# EAGLE design WiFi_Board_R0 (EAGLE 6.6.0)
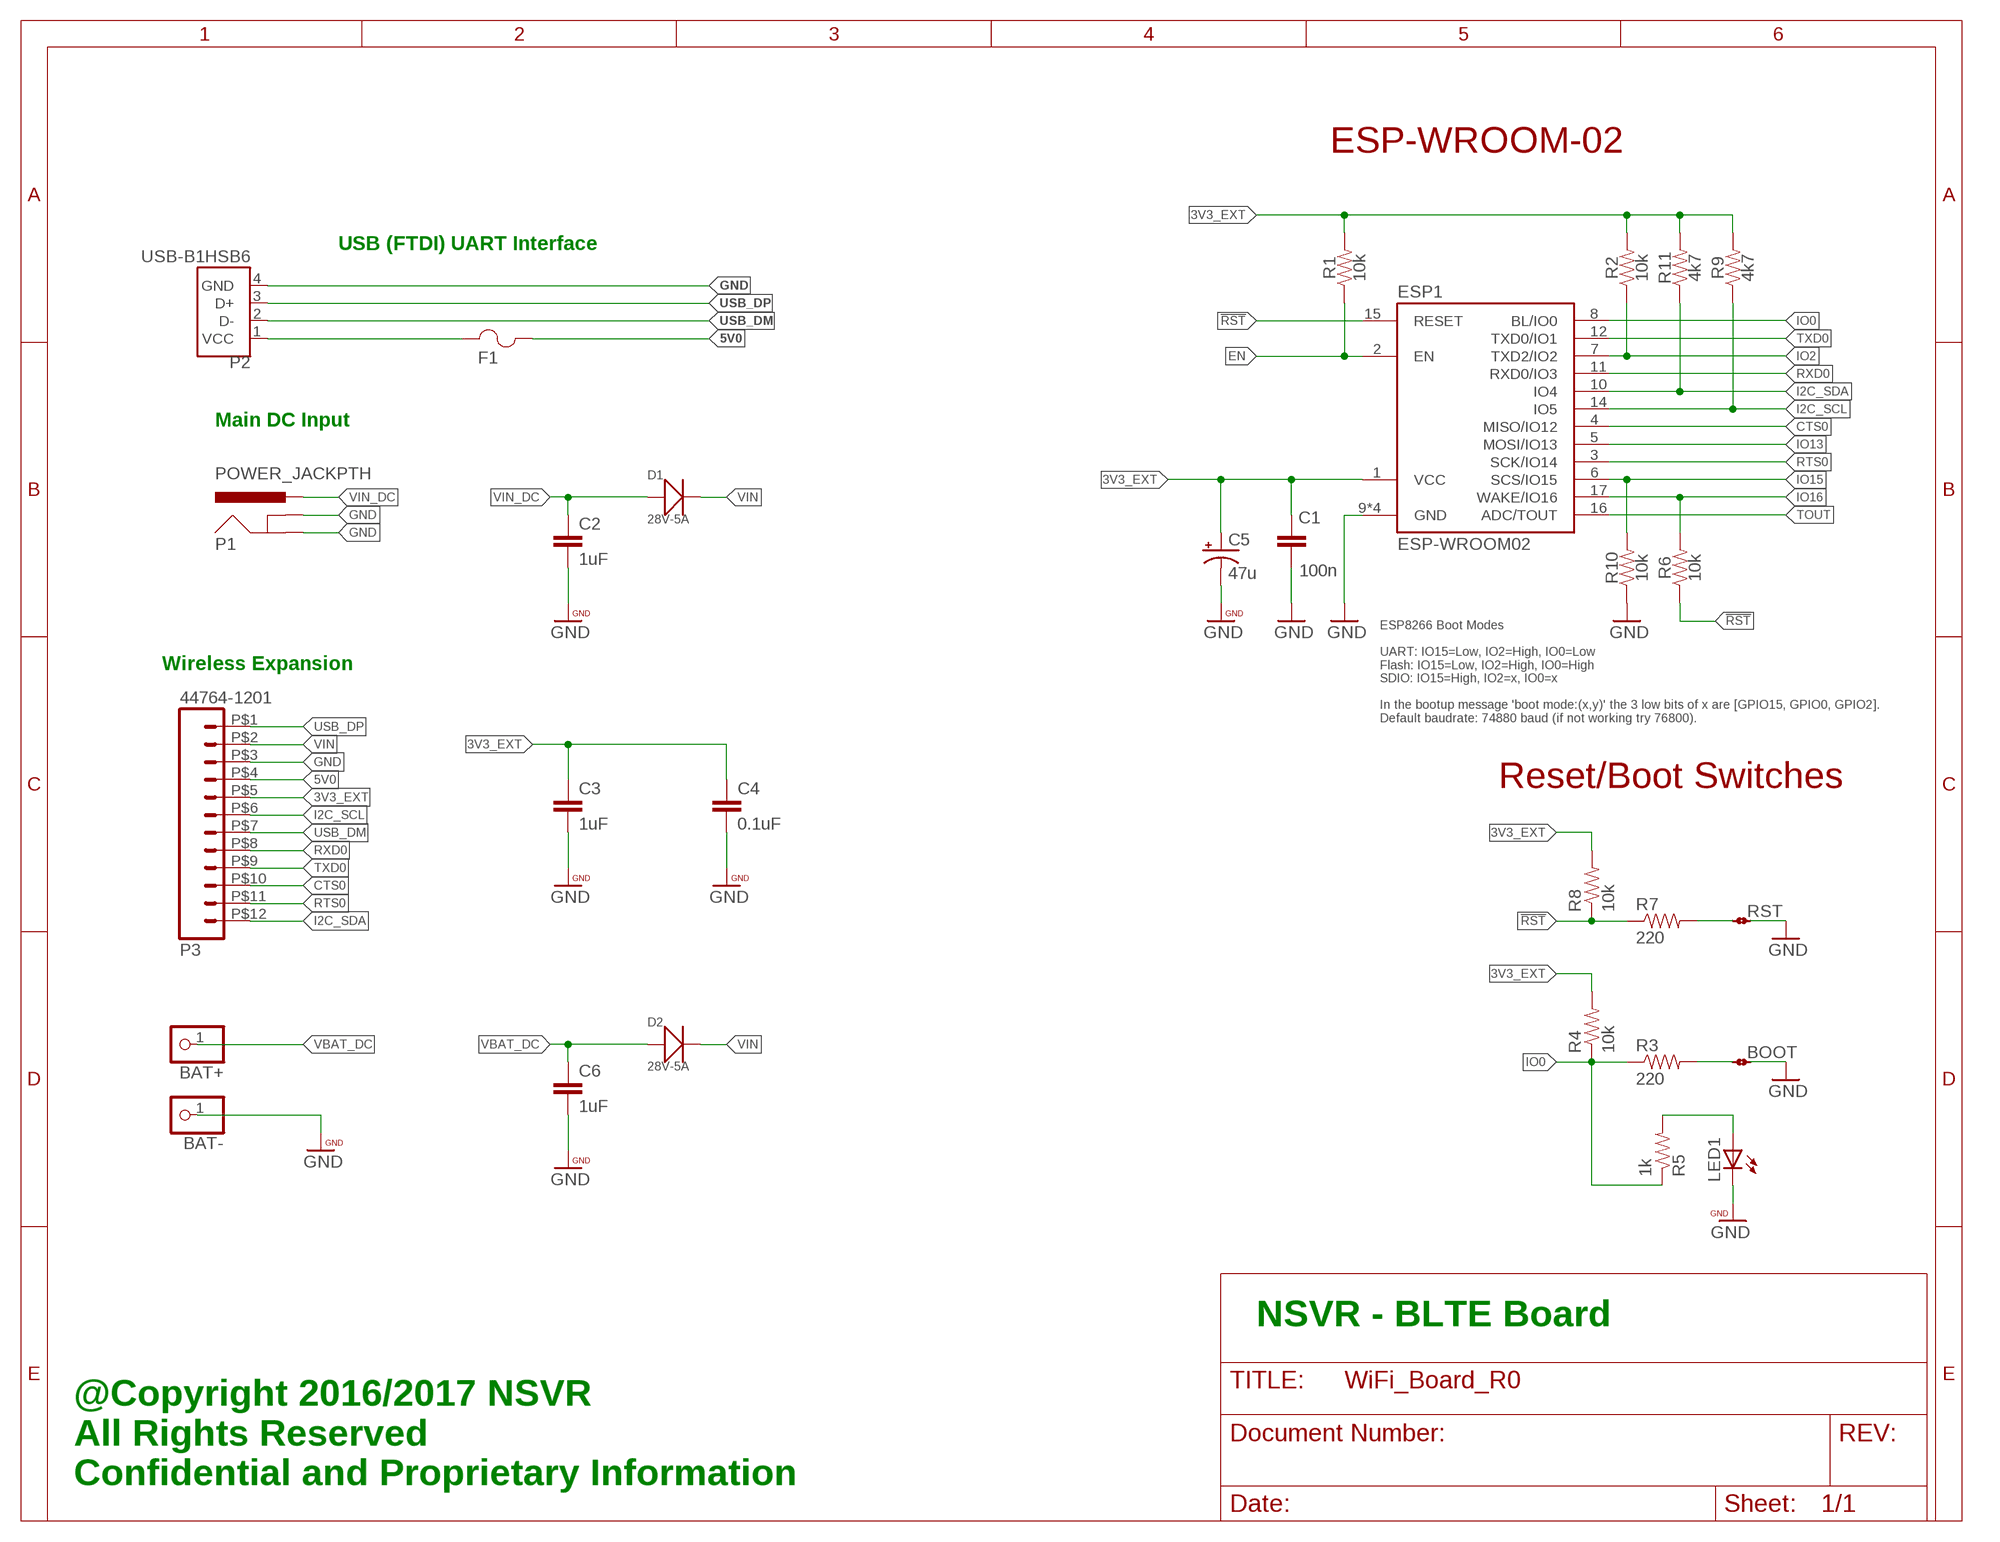
[diagram p0: schematic, sheet 1]

## Parts
BAT+  WPAD-1-PTH  [WPAD-1-PTH-2.54]
BAT-  WPAD-1-PTH  [WPAD-1-PTH-2.54]
BOOT  JMP-2-NO-PTH  [JMP-2-NO-PTH-2.54]
C1  100n  CAP0402-CAP  [0402-CAP]
C2  1uF  CAP0402-CAP  [0402-CAP]
C3  1uF  CAP0402-CAP  [0402-CAP]
C4  0.1uF  CAP0402-CAP  [0402-CAP]
C5  47u  CAP_POLD  [PANASONIC_D]
C6  1uF  CAP0402-CAP  [0402-CAP]
D1  28V-5A  SMD-DIODE-SCHOTTKY-28V-5A(DO-214AA)  [DO-214AA]
D2  28V-5A  SMD-DIODE-SCHOTTKY-28V-5A(DO-214AA)  [DO-214AA]
ESP1  ESP-WROOM02  [ESP-WROOM02]
F1  1206L050YR  [1206LSERIES]
LED1  LEDCHIP-LED0603  [CHIP-LED0603]
P1  POWER_JACKPTH  [POWER_JACK_PTH]
P2  USB-B1HSB6  [OST_USB-B1HSB6]
P3  44764-1201  [44764-1201]
R1  10k  RESISTOR0402-TYP  [EIA-0402]
R2  10k  RESISTOR0402-TYP  [EIA-0402]
R3  220  RESISTOR0402-TYP  [EIA-0402]
R4  10k  RESISTOR0402-TYP  [EIA-0402]
R5  1k  RESISTOR0402-TYP  [EIA-0402]
R6  10k  RESISTOR0402-TYP  [EIA-0402]
R7  220  RESISTOR0402-TYP  [EIA-0402]
R8  10k  RESISTOR0402-TYP  [EIA-0402]
R9  4k7  RESISTOR0402-TYP  [EIA-0402]
R10  10k  RESISTOR0402-TYP  [EIA-0402]
R11  4k7  RESISTOR0402-TYP  [EIA-0402]
RST  JMP-2-NO-PTH  [JMP-2-NO-PTH-2.54]

## Nets
3V3_EXT: C1.2 C3.1 C4.1 C5.+ ESP1.1(VCC) P3.P$5 R1.2 R2.2 R4.2 R8.2 R9.2 R11.2
5V0: F1.2 P3.P$4
!RST: ESP1.15(RESET) R6.1 R7.1 R8.1
CTS0: ESP1.4(MISO/IO12) P3.P$10
EN: ESP1.2(EN) R1.1
GND: BAT-.1 BOOT.2 C1.1 C2.2 C3.2 C4.2 C5.- C6.2 ESP1.9(GND) ESP1.13(GND) ESP1.18(GND) ESP1.TP(GND) LED1.C P1.GND P1.GNDBREAK P2.4(GND) P3.P$3 R10.1 RST.2
I2C_SCL: ESP1.14(IO5) P3.P$6 R9.1
I2C_SDA: ESP1.10(IO4) P3.P$12 R11.1
IO0: ESP1.8(BL/IO0) R3.1 R4.1 R5.1
IO2: ESP1.7(TXD2/IO2) R2.1
IO13: ESP1.5(MOSI/IO13)
IO15: ESP1.6(SCS/IO15) R10.2
IO16: ESP1.17(WAKE/IO16) R6.2
LED1: LED1.A R5.2
N$1: R7.2 RST.1
N$2: BOOT.1 R3.2
RTS0: ESP1.3(SCK/IO14) P3.P$11
RXD0: ESP1.11(RXD0/IO3) P3.P$8
TOUT: ESP1.16(ADC/TOUT)
TXD0: ESP1.12(TXD0/IO1) P3.P$9
USB_DM: P2.2(D-) P3.P$7
USB_DP: P2.3(D+) P3.P$1
VBAT_DC: BAT+.1 C6.1 D2.+
VBUS_IN: F1.1 P2.1(VCC)
VIN: D1.- D2.- P3.P$2
VIN_DC: C2.1 D1.+ P1.PWR

## Notes on the sheet
- ESP-WROOM-02
- USB (FTDI) UART Interface
- Main DC Input
- ESP8266 Boot Modes
  
  UART: IO15=Low, IO2=High, IO0=Low
  Flash: IO15=Low, IO2=High, IO0=High
  SDIO: IO15=High, IO2=x, IO0=x
  
  In the bootup message 'boot mode:(x,y)' the 3 low bits of x are [GPIO15, GPIO0, GPIO2].
  Default baudrate: 74880 baud (if not working try 76800).
- Wireless Expansion
- Reset/Boot Switches
- NSVR - BLTE Board
- @Copyright 2016/2017 NSVR
  All Rights Reserved
  Confidential and Proprietary Information

## Library data of the parts
BAT+ BAT- = PatternAgents-ProtoPads:WPAD-1: Wire Pad - Single Good for scope lead clips, test jumpers, probe points, etc. PatternAgents ProtoPads Library Schematic and PCB layout libraries for design patterns by PatternAgents. For the CADSoft Eagle CAD program : http://www.cadsoftusa.com/download-eagle/ Source LBR : http://www.patternagents.com Github : https://github.com/PatternAgents License : http://creativecommons.org/licenses/by-sa/4.0/ (Creative Commons 4.0) THIS SOFTWARE IS PROVIDED BY THE CONTRIBUTORS "AS IS" AND WITHOUT ANY EXPRESS OR IMPLIED WARRANTIES, INCLUDING, BUT NOT LIMITED TO, THE IMPLIED WARRANTIES OF MERCHANTABILITY AND FITNESS FOR A PARTICULAR PURPOSE ARE DISCLAIMED. IN NO EVENT SHALL THE COPYRIGHT OWNER OR CONTRIBUTORS BE LIABLE FOR ANY DIRECT, INDIRECT, INCIDENTAL, SPECIAL, EXEMPLARY, OR CONSEQUENTIAL DAMAGES (INCLUDING, BUT NOT LIMITED TO, PROCUREMENT OF SUBSTITUTE GOODS OR SERVICES; LOSS OF USE, DATA, OR PROFITS; OR BUSINESS INTERRUPTION) HOWEVER CAUSED AND ON ANY THEORY OF LIABILITY, WHETHER IN CONTRACT, STRICT LIABILITY, OR TORT (INCLUDING NEGLIGENCE OR OTHERWISE) ARISING IN ANY WAY OUT OF THE USE OF THIS SOFTWARE, EVEN IF ADVISED OF THE POSSIBILITY OF SUCH DAMAGE.; BOM: EXCLUDE
BOOT RST = PatternAgents-ProtoPads:JMP-2-NO: Two Terminal Jumper - Normally Open Positions 1 and 2 are normally NOT connected. PatternAgents ProtoPads Library Schematic and PCB layout libraries for design patterns by PatternAgents. For the CADSoft Eagle CAD program : http://www.cadsoftusa.com/download-eagle/ Source LBR : http://www.patternagents.com Github : https://github.com/PatternAgents License : http://creativecommons.org/licenses/by-sa/4.0/ (Creative Commons 4.0) THIS SOFTWARE IS PROVIDED BY THE CONTRIBUTORS "AS IS" AND WITHOUT ANY EXPRESS OR IMPLIED WARRANTIES, INCLUDING, BUT NOT LIMITED TO, THE IMPLIED WARRANTIES OF MERCHANTABILITY AND FITNESS FOR A PARTICULAR PURPOSE ARE DISCLAIMED. IN NO EVENT SHALL THE COPYRIGHT OWNER OR CONTRIBUTORS BE LIABLE FOR ANY DIRECT, INDIRECT, INCIDENTAL, SPECIAL, EXEMPLARY, OR CONSEQUENTIAL DAMAGES (INCLUDING, BUT NOT LIMITED TO, PROCUREMENT OF SUBSTITUTE GOODS OR SERVICES; LOSS OF USE, DATA, OR PROFITS; OR BUSINESS INTERRUPTION) HOWEVER CAUSED AND ON ANY THEORY OF LIABILITY, WHETHER IN CONTRACT, STRICT LIABILITY, OR TORT (INCLUDING NEGLIGENCE OR OTHERWISE) ARISING IN ANY WAY OUT OF THE USE OF THIS SOFTWARE, EVEN IF ADVISED OF THE POSSIBILITY OF SUCH DAMAGE.; BOM: EXCLUDE
C1-C4 C6 = PatternAgents-ProtoPads:CAP: Capacitor Standard 0603 ceramic capacitor, and 0.1" leaded capacitor.
C5 = SparkFun-Capacitors:CAP_POL: Capacitor Polarized These are standard SMD and PTH capacitors. Normally 10uF, 47uF, and 100uF in electrolytic and tantalum varieties. Always verify the external diameter of the through hole cap, it varies with capacity, voltage, and manufacturer. The EIA devices should be standard.
D1 D2 = Seeed-Diode-2016:SMD-DIODE-SCHOTTKY-28V-5A(DO-214AA): 304020021; MPN: SS54B
ESP1 = we-chip:ESP-WROOM02: Espressif ESP-WROOM-02 and AI-Thinker ESP-12 ESP8266 WiFi/WLAN Module
F1 = 1206L050:1206L050YR; COPYRIGHT: Copyright C 2015 Accelerated Designs. All rights reserved; MANUFACTURER_PART_NUMBER: 1206L050YR; VENDOR: Littelfuse Inc
LED1 = led:LED: LED OSRAM: - CHIPLED LG R971, LG N971, LY N971, LG Q971, LY Q971, LO R971, LY R971 LH N974, LH R974 LS Q976, LO Q976, LY Q976 LO Q996 - Hyper CHIPLED LW Q18S LB Q993, LB Q99A, LB R99A - SideLED LS A670, LO A670, LY A670, LG A670, LP A670 LB A673, LV A673, LT A673, LW A673 LH A674 LY A675 LS A676, LA A676, LO A676, LY A676, LW A676 LS A679, LY A679, LG A679 - Hyper Micro SIDELED® LS Y876, LA Y876, LO Y876, LY Y876 LT Y87S - SmartLED LW L88C, LW L88S LB L89C, LB L89S, LG L890 LS L89K, LO L89K, LY L89K LS L896, LA L896, LO L896, LY L896 - TOPLED LS T670, LO T670, LY T670, LG T670, LP T670 LSG T670, LSP T670, LSY T670, LOP T670, LYG T670 LG T671, LOG T671, LSG T671 LB T673, LV T673, LT T673, LW T673 LH T674 LS T676, LA T676, LO T676, LY T676, LB T676, LH T676, LSB T676, LW T676 LB T67C, LV T67C, LT T67C, LS T67K, LO T67K, LY T67K, LW E67C LS E67B, LA E67B, LO E67B, LY E67B, LB E67C, LV E67C, LT E67C LW T67C LS T679, LY T679, LG T679 LS T770, LO T770, LY T770, LG T770, LP T770 LB T773, LV T773, LT T773, LW T773 LH T774 LS E675, LA E675, LY E675, LS T675 LS T776, LA T776, LO T776, LY T776, LB T776 LHGB T686 LT T68C, LB T68C - Hyper Mini TOPLED® LB M676 - Mini TOPLED Santana® LG M470 LS M47K, LO M47K, LY M47K Source: http://www.osram.convergy.de LUXEON: - LUMILED® LXK2-PW12-R00, LXK2-PW12-S00, LXK2-PW14-U00, LXK2-PW14-V00 LXK2-PM12-R00, LXK2-PM12-S00, LXK2-PM14-U00 LXK2-PE12-Q00, LXK2-PE12-R00, LXK2-PE12-S00, LXK2-PE14-T00, LXK2-PE14-U00 LXK2-PB12-K00, LXK2-PB12-L00, LXK2-PB12-M00, LXK2-PB14-N00, LXK2-PB14-P00, LXK2-PB14-Q00 LXK2-PR12-L00, LXK2-PR12-M00, LXK2-PR14-Q00, LXK2-PR14-R00 LXK2-PD12-Q00, LXK2-PD12-R00, LXK2-PD12-S00 LXK2-PH12-R00, LXK2-PH12-S00 LXK2-PL12-P00, LXK2-PL12-Q00, LXK2-PL12-R00 Source: www.luxeon.com KINGBRIGHT: KA-3528ASYC Source: www.kingbright.com
P1 = SparkFun-Connectors:POWER_JACK: Power Jack This is the standard 5.5mm barrel jack for power. The PTH is the most common, proven, reliable, footprint. The Slot footprint only works if the mill layer is transmitted to the PCB fab house so be warned. Mating wall wart : TOL-00298 (and others); PROD_ID: CONN-08197
P2 = USB-B1HSB6:USB-B1HSB6: Conn Usb Type b r/a Black; AVAILABILITY: Warning; DESCRIPTION: Conn Usb Type b r/a Black; MF: On Shore Technology; MP: USB-B1HSB6; PACKAGE: None; PRICE: 0.42 USD
P3 = nsvr:44764-1201
R1-R11 = PatternAgents-ProtoPads:RESISTOR: Resistor Basic schematic elements and footprints for 0603, 1206, and PTH resistors.

## Board
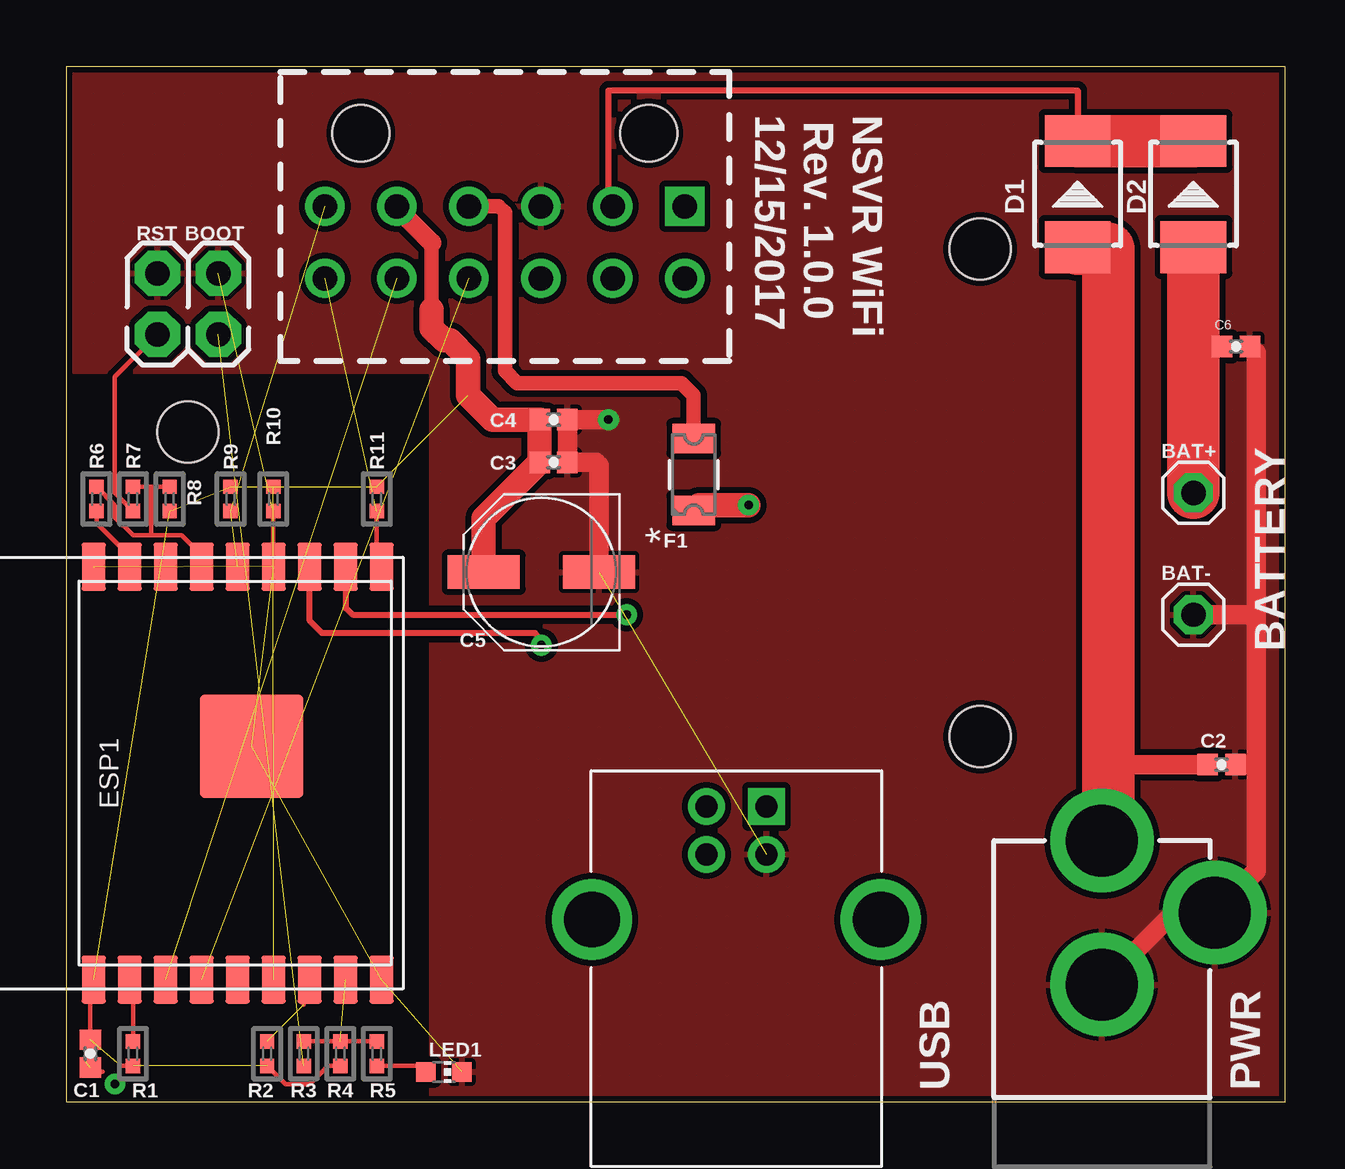
[diagram p1: board, top side]
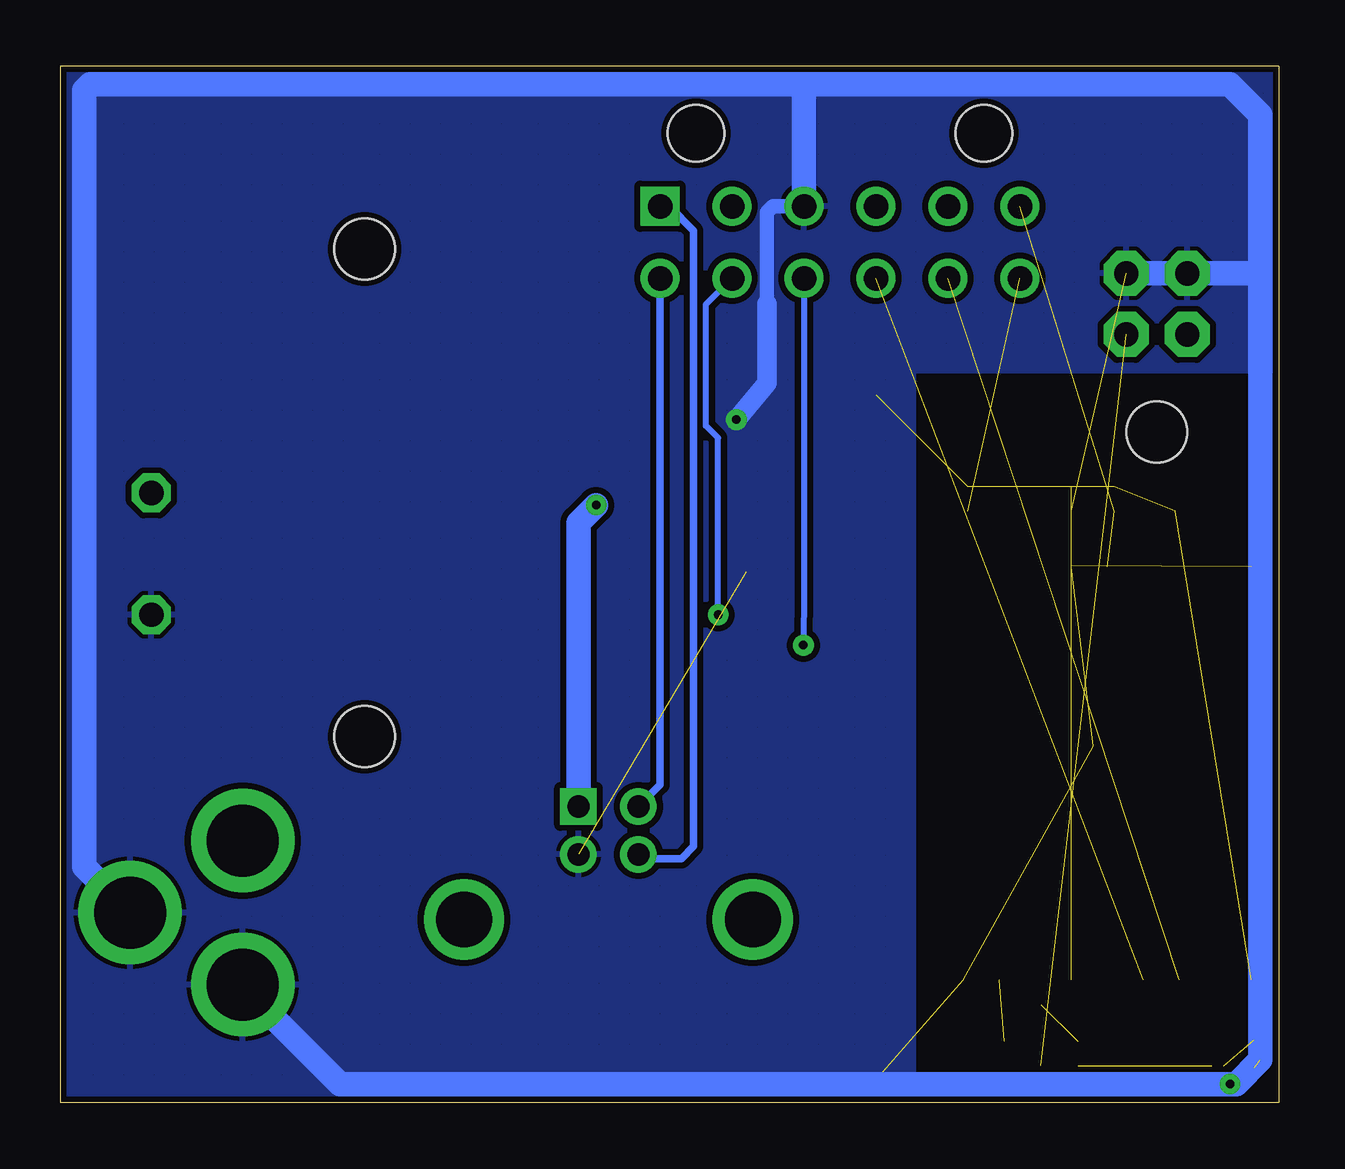
[diagram p2: board, bottom side, seen from below]

Size 50.8 x 43.18 mm. Coordinates in mm from the lower left corner, seen from the top.
Outline: 0,43.18 0,0 50.8,0 50.8,43.18 0,43.18
Copper layers (1*16): Top 0.035mm / dielectric 1.5mm / Bottom 0.035mm
Design rules "PatternAgents_7mil": minimum track width 7mil, minimum drill 14mil, track to track 7mil, track to pad 7mil, pad to pad 7mil, via to via 7mil, smd to smd 7mil, copper to edge 7mil, drill to drill 7mil, minimum pad ring 12mil, minimum via ring 10mil, stop-mask expansion 4mil, vias tented up to drill 25mil, thermal gap 7mil
Holes 2.54 mm at 38.1,35.56 5.08,27.94 38.1,15.24

### Footprints (pad centres in the part's own frame; a part is rotated, then mirrored left to right if it is on the bottom)
WPAD-1-PTH-2.54 = drill 1.016 octagon: 1 0,0
JMP-2-NO-PTH-2.54 = drill 1.016 pad 1.88 octagon: 1 0,0; 2 2.54,0
0402-CAP = smd 0.85 x 0.9: 1 -0.58,0; 2 0.58,0
PANASONIC_D = smd 3 x 1.4: + 2.4,0; - -2.4,0
DO-214AA = smd 2.159 x 2.743: + -2.21,0; - 2.21,0
ESP-WROOM02 = smd 2 x 1: 1 -8.6,1.9; 2 -8.6,0.4; 3 -8.6,-1.1; 4 -8.6,-2.6; 5 -8.6,-4.1; 6 -8.6,-5.6; 7 -8.6,-7.1; 8 -8.6,-8.6; 9 -8.6,-10.1; 10 8.6,-10.1; 11 8.6,-8.6; 12 8.6,-7.1; 13 8.6,-5.6; 14 8.6,-4.1; 15 8.6,-2.6; 16 8.6,-1.1; 17 8.6,0.4; 18 8.6,1.9 | smd 4.3 x 4.3: TP 1.12,-4.68
1206LSERIES = smd 1.219 x 1.778: 1 -1.499,0; 2 1.499,0
CHIP-LED0603 = smd 0.8 x 0.8: A 0,-0.75; C 0,0.75
POWER_JACK_PTH = drill 2.997 pad 4.318: GND 0,7.7; GNDBREAK 4.7,10.7; PWR 0,13.7
OST_USB-B1HSB6 = drill 0.92 square: 1 1.25,4.71 | drill 0.92: 2 -1.25,4.71; 3 -1.25,2.71; 4 1.25,2.71 | drill 2.33: P1 -6.02,0; P2 6.02,0
44764-1201 = drill 1.02 square: P$1 -7.5,0 | drill 1.02: P$2 -4.5,0; P$3 -1.5,0; P$4 1.5,0; P$5 4.5,0; P$6 7.5,0; P$7 -7.5,3; P$8 -4.5,3; P$9 -1.5,3; P$10 1.5,3; P$11 4.5,3; P$12 7.5,3 | hole 2.36: -6,-3.05; 6,-3.05
EIA-0402 = smd 0.6 x 0.6: 1 -0.508,0; 2 0.508,0

### Placement (x,y rotation side)
BAT+  46.99,25.4 0 top
BAT-  46.99,20.32 0 top
BOOT  6.35,32 90 top
C1  1.02,2.03 90 top
C2  48.16,14.07 0 top
C3  20.32,26.67 0 top
C4  20.32,28.45 0 top
C5  19.81,22.1 180 top
C6  48.77,31.5 0 top
D1  42.16,37.85 90 top
D2  46.99,37.85 90 top
ESP1  3.05,13.72 90 top
F1  26.16,26.16 90 top
LED1  15.75,1.27 270 top
P1  43.18,-2.79 0 top
P2  27.94,7.62 0 top
P3  18.29,37.34 180 top
R1  2.79,2.03 270 top
R2  8.38,2.03 270 top
R3  9.91,2.03 270 top
R4  11.43,2.03 270 top
R5  12.95,2.03 270 top
R6  1.27,25.15 270 top
R7  2.79,25.15 270 top
R8  4.32,25.15 270 top
R9  6.86,25.15 90 top
R10  8.64,25.15 90 top
R11  12.95,25.15 90 top
RST  3.81,32 90 top

### Tracks (layer width: path | path; a pad name or v marks a point on that pad's centre or on a via)
3V3_EXT  (6 unrouted)
  Top 0.178: 2.29,1.52 R1.2 | R4.2 10.92,1.52 10.16,0.76 9.14,0.76 R2.2 | C1.2 1.02,5.08 ESP1.1
  Top 0.61: 15.24,35.81 15.24,33.02
  Top 0.813: P3.P$5 13.79,37.27 15.24,35.81
  Top 1.016: 15.24,33.02 15.24,32.26 15.75,31.75 16,31.75 16.76,30.99 16.76,29.46 17.78,28.45 C4.1 C3.1 17.41,24.34 C5.+
5V0
  Top 0.61: P3.P$4 18.03,37.34 18.29,37.08 18.29,30.48 18.8,29.97 25.65,29.97 26.16,29.46 F1.2
!RST
  Top 0.178: R8.1 3.56,25.65 | 3.56,25.65 R7.1 | R6.1 2.03,24.89 2.03,24.38 2.79,23.62 3.56,23.62 | 3.56,23.62 4.83,23.62 5.59,22.86 5.59,22.35 ESP1.15 | 3.56,23.62 3.56,25.65
CTS0  (1 unrouted)
EN
  Top 0.178: R1.1 2.79,5.08 ESP1.2
GND  (via drill 0.36)  (7 unrouted)
  Top 0.178: 1.52,1.27 1.02,1.27 C1.1 | R10.1 8.64,22.35 ESP1.13
  Top 0.813: 49.02,14.07 C2.2 49.52,14.07 49.62,13.97 | 49.62,20.32 49.62,13.97 | 49.62,13.97 49.62,9.64 P1.GNDBREAK 46.18,7.91 P1.GND | BAT-.1 49.62,20.32 | 49.62,20.32 49.62,31.23 C6.2 | C5.- 22.21,26.56 22.1,26.67 C3.2 C4.2 v22.61,28.45
  Bottom 0.61: 21.34,33.27 21.34,37.08 21.08,37.34 P3.P$3
  Bottom 0.813: 21.34,33.27 21.34,29.97 v22.61,28.45
  Bottom 1.016: 19.81,42.42 2.03,42.42 0.76,41.15 0.76,34.54 | 19.81,42.42 49.53,42.42 49.78,42.16 49.78,9.81 P1.GNDBREAK | 0.76,34.54 0.76,1.78 1.78,0.76 v2.03,0.76 39.12,0.76 43.18,4.83 | P3.P$3 19.79,42.39 19.81,42.42 | BOOT.2 RST.2 0.76,34.54
  pour Top (isolate 0.254, hatched): 15.24,0 50.8,0 50.8,43.18 0,43.18 0,30.48 15.24,30.48
  pour Bottom (isolate 0.254, hatched): 15.24,0 50.8,0 50.8,43.18 0,43.18 0,30.48 15.24,30.48
I2C_SCL  (2 unrouted)
I2C_SDA  (1 unrouted)
  Top 0.178: R11.1 12.95,22.35 ESP1.10
IO0  (1 unrouted)
  Top 0.178: R3.1 R4.1 R5.1
IO2  (1 unrouted)
  Top 0.178: 9.91,4.06 9.91,5.08 ESP1.7
IO15  (1 unrouted)
IO16
  Top 0.178: R6.2 1.27,24.13 2.54,22.86 2.54,22.35 ESP1.17
LED1
  Top 0.178: R5.2 14.73,1.52 14.99,1.27 LED1.A
N$1
  Top 0.178: R7.2 2.03,25.4 2.03,30.23 RST.1
N$2  (1 unrouted)
RTS0  (1 unrouted)
RXD0  (via drill 0.36)
  Top 0.254: ESP1.11 11.65,20.61 11.94,20.32 v23.37,20.32
  Bottom 0.254: v23.37,20.32 23.37,27.69 23.88,28.19 23.88,33.25 P3.P$8
TXD0  (via drill 0.36)
  Top 0.254: v19.81,19.05 19.81,19.3 19.56,19.56 10.67,19.56 10.16,20.07 10.16,22.3 ESP1.12
  Bottom 0.254: P3.P$9 19.79,21.36 v19.81,19.05
USB_DM
  Bottom 0.305: P3.P$7 25.79,13.23 P2.2
USB_DP
  Bottom 0.305: P3.P$1 25.4,37.34 24.38,36.32 24.38,10.67 24.89,10.16 26.52,10.16 P2.3
VBAT_DC
  Top 0.813: C6.1 46.99,31.5
  Top 2.184: BAT+.1 46.99,31.5 D2.+
VBUS_IN  (via drill 0.36)
  Top 1.016: v28.45,24.89 26.39,24.89 F1.1
  Bottom 1.016: P2.1 29.19,24.15 v28.45,24.89
VIN
  Top 0.254: P3.P$2 22.61,37.34 22.61,42.16 42.16,42.16 D1.-
  Top 2.184: D2.- D1.-
  pour Top (isolate 0.254, rank 2, hatched): 24.13,35.81 21.34,35.81 21.34,42.93 50.55,42.93 50.55,38.61 28.45,38.86 24.13,38.86
VIN_DC
  Top 0.813: C2.1 43.43,14.07 43.43,14.22
  Top 2.184: P1.PWR 43.43,10.91 43.43,14.22 43.43,35.56 42.16,35.56 D1.+

### Text on the board
tPlace: 12/15/2017 | Rev. 1.0.0 | NSVR WiFi | F1 | BATTERY | USB | PWR